# Altium schematic sheet Sheet1.SchDoc
size A4
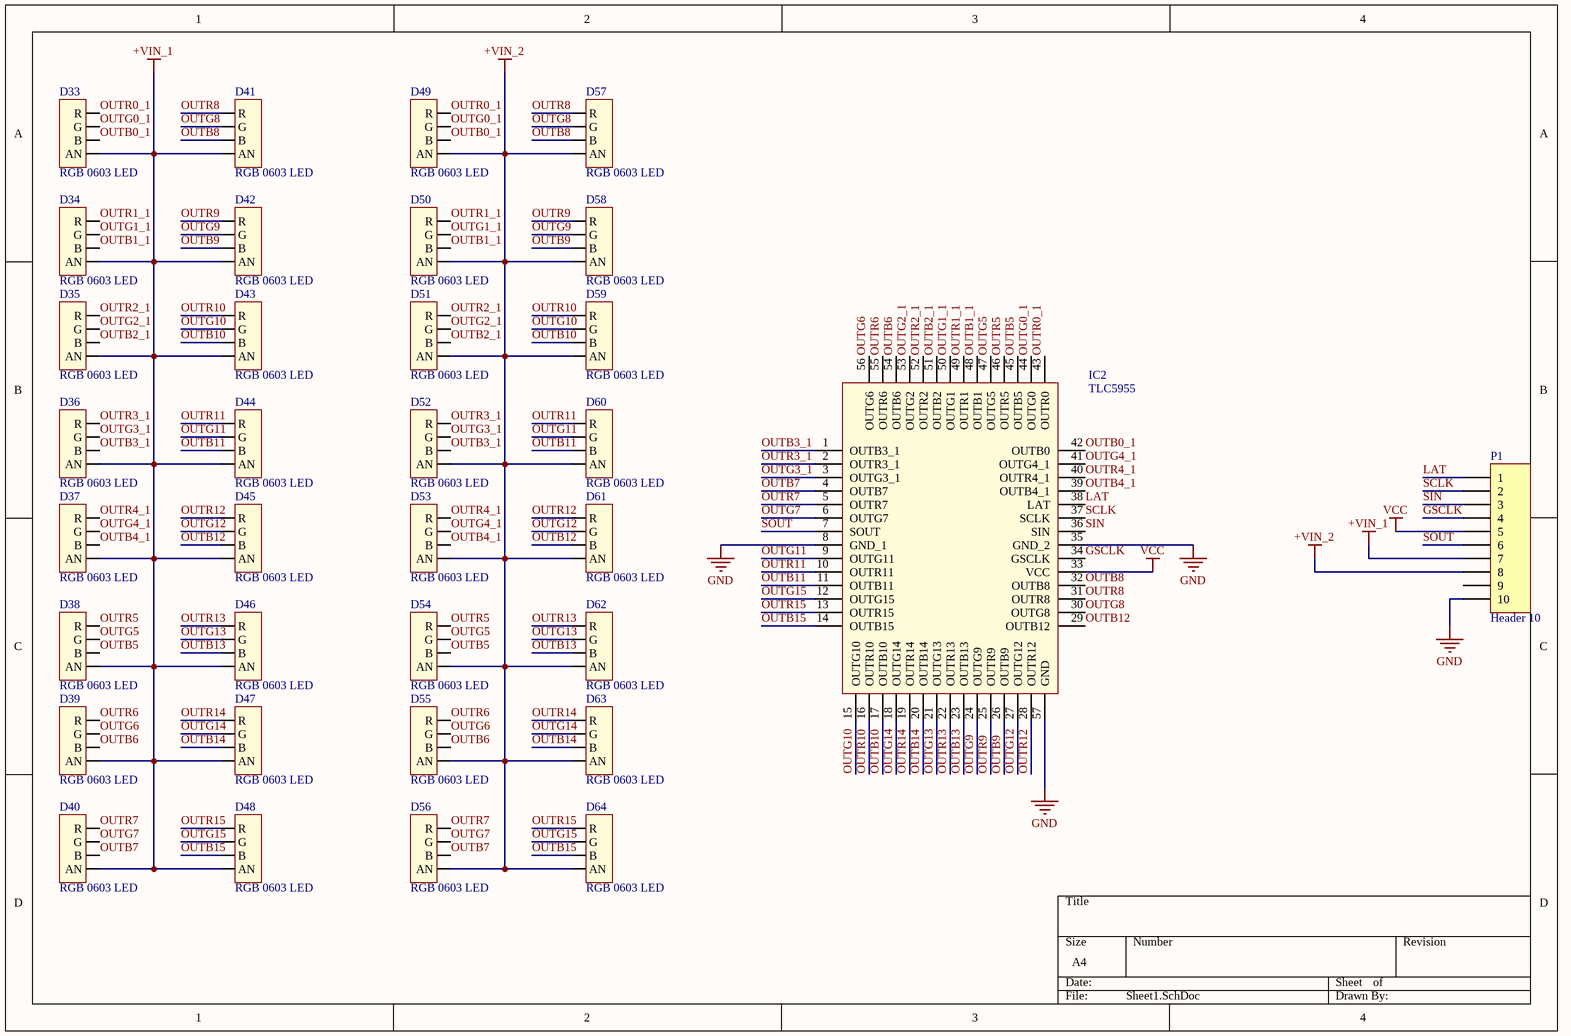
[diagram p0: Sheet1.SchDoc]

## Parts
D33  RGB 0603 LED  [RGB LED]
D34  RGB 0603 LED  [RGB LED]
D35  RGB 0603 LED  [RGB LED]
D36  RGB 0603 LED  [RGB LED]
D37  RGB 0603 LED  [RGB LED]
D38  RGB 0603 LED  [RGB LED]
D39  RGB 0603 LED  [RGB LED]
D40  RGB 0603 LED  [RGB LED]
D41  RGB 0603 LED  [RGB LED]
D42  RGB 0603 LED  [RGB LED]
D43  RGB 0603 LED  [RGB LED]
D44  RGB 0603 LED  [RGB LED]
D45  RGB 0603 LED  [RGB LED]
D46  RGB 0603 LED  [RGB LED]
D47  RGB 0603 LED  [RGB LED]
D48  RGB 0603 LED  [RGB LED]
D49  RGB 0603 LED  [RGB LED]
D50  RGB 0603 LED  [RGB LED]
D51  RGB 0603 LED  [RGB LED]
D52  RGB 0603 LED  [RGB LED]
D53  RGB 0603 LED  [RGB LED]
D54  RGB 0603 LED  [RGB LED]
D55  RGB 0603 LED  [RGB LED]
D56  RGB 0603 LED  [RGB LED]
D57  RGB 0603 LED  [RGB LED]
D58  RGB 0603 LED  [RGB LED]
D59  RGB 0603 LED  [RGB LED]
D60  RGB 0603 LED  [RGB LED]
D61  RGB 0603 LED  [RGB LED]
D62  RGB 0603 LED  [RGB LED]
D63  RGB 0603 LED  [RGB LED]
D64  RGB 0603 LED  [RGB LED]
IC2  TLC5955  [TLC5955]
P1  Header 10  [HDR1X10]

## Nets
+VIN_1: D33.4(AN) D34.4(AN) D35.4(AN) D36.4(AN) D37.4(AN) D38.4(AN) D39.4(AN) D40.4(AN) D41.4(AN) D42.4(AN) D43.4(AN) D44.4(AN) D45.4(AN) D46.4(AN) D47.4(AN) D48.4(AN) P1.7
+VIN_2: D49.4(AN) D50.4(AN) D51.4(AN) D52.4(AN) D53.4(AN) D54.4(AN) D55.4(AN) D56.4(AN) D57.4(AN) D58.4(AN) D59.4(AN) D60.4(AN) D61.4(AN) D62.4(AN) D63.4(AN) D64.4(AN) P1.8
GND: IC2.8(GND_1) IC2.35(GND_2) IC2.57(GND) P1.10
VCC: IC2.33(VCC) P1.5
GSCLK: IC2.34(GSCLK) P1.4
LAT: IC2.38(LAT) P1.1
OUTB0_1: D33.3(B) D49.3(B) IC2.42(OUTB0)
OUTB1_1: D34.3(B) D50.3(B) IC2.48(OUTB1)
OUTB2_1: D35.3(B) D51.3(B) IC2.51(OUTB2)
OUTB3_1: D36.3(B) D52.3(B) IC2.1(OUTB3_1)
OUTB4_1: D37.3(B) D53.3(B) IC2.39(OUTB4_1)
OUTB5: D38.3(B) D54.3(B) IC2.45(OUTB5)
OUTB6: D39.3(B) D55.3(B) IC2.54(OUTB6)
OUTB7: D40.3(B) D56.3(B) IC2.4(OUTB7)
OUTB8: D41.3(B) D57.3(B) IC2.32(OUTB8)
OUTB9: D42.3(B) D58.3(B) IC2.26(OUTB9)
OUTB10: D43.3(B) D59.3(B) IC2.17(OUTB10)
OUTB11: D44.3(B) D60.3(B) IC2.11(OUTB11)
OUTB12: D45.3(B) D61.3(B) IC2.29(OUTB12)
OUTB13: D46.3(B) D62.3(B) IC2.23(OUTB13)
OUTB14: D47.3(B) D63.3(B) IC2.20(OUTB14)
OUTB15: D48.3(B) D64.3(B) IC2.14(OUTB15)
OUTG0_1: D33.2(G) D49.2(G) IC2.44(OUTG0)
OUTG1_1: D34.2(G) D50.2(G) IC2.50(OUTG1)
OUTG2_1: D35.2(G) D51.2(G) IC2.53(OUTG2)
OUTG3_1: D36.2(G) D52.2(G) IC2.3(OUTG3_1)
OUTG4_1: D37.2(G) D53.2(G) IC2.41(OUTG4_1)
OUTG5: D38.2(G) D54.2(G) IC2.47(OUTG5)
OUTG6: D39.2(G) D55.2(G) IC2.56(OUTG6)
OUTG7: D40.2(G) D56.2(G) IC2.6(OUTG7)
OUTG8: D41.2(G) D57.2(G) IC2.30(OUTG8)
OUTG9: D42.2(G) D58.2(G) IC2.24(OUTG9)
OUTG10: D43.2(G) D59.2(G) IC2.15(OUTG10)
OUTG11: D44.2(G) D60.2(G) IC2.9(OUTG11)
OUTG12: D45.2(G) D61.2(G) IC2.27(OUTG12)
OUTG13: D46.2(G) D62.2(G) IC2.21(OUTG13)
OUTG14: D47.2(G) D63.2(G) IC2.18(OUTG14)
OUTG15: D48.2(G) D64.2(G) IC2.12(OUTG15)
OUTR0_1: D33.1(R) D49.1(R) IC2.43(OUTR0)
OUTR1_1: D34.1(R) D50.1(R) IC2.49(OUTR1)
OUTR2_1: D35.1(R) D51.1(R) IC2.52(OUTR2)
OUTR3_1: D36.1(R) D52.1(R) IC2.2(OUTR3_1)
OUTR4_1: D37.1(R) D53.1(R) IC2.40(OUTR4_1)
OUTR5: D38.1(R) D54.1(R) IC2.46(OUTR5)
OUTR6: D39.1(R) D55.1(R) IC2.55(OUTR6)
OUTR7: D40.1(R) D56.1(R) IC2.5(OUTR7)
OUTR8: D41.1(R) D57.1(R) IC2.31(OUTR8)
OUTR9: D42.1(R) D58.1(R) IC2.25(OUTR9)
OUTR10: D43.1(R) D59.1(R) IC2.16(OUTR10)
OUTR11: D44.1(R) D60.1(R) IC2.10(OUTR11)
OUTR12: D45.1(R) D61.1(R) IC2.28(OUTR12)
OUTR13: D46.1(R) D62.1(R) IC2.22(OUTR13)
OUTR14: D47.1(R) D63.1(R) IC2.19(OUTR14)
OUTR15: D48.1(R) D64.1(R) IC2.13(OUTR15)
SCLK: IC2.37(SCLK) P1.2
SIN: IC2.36(SIN) P1.3
SOUT: IC2.7(SOUT) P1.6

Not connected (* = marked no-connect by the designer): P1 9

## Library data of the parts
P1 = Header 10: Header, 10-Pin; LatestRevisionDate: 17-Jul-2002; LatestRevisionNote: Re-released for DXP Platform.; Publisher: Altium Limited